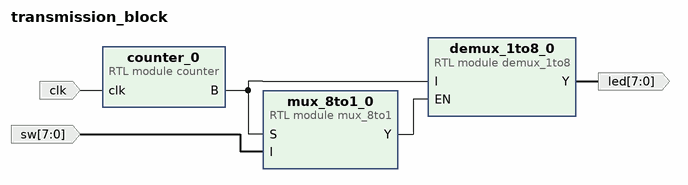
[diagram p0: block diagram of the top level]
# Vivado block design transmission_block, xc7z007sclg400-2, Vivado 2025.1
create_bd_design transmission_block

create_bd_port -dir I -from 7 -to 0 sw
create_bd_port -dir O -from 7 -to 0 led
create_bd_port -dir I -type clk clk

create_bd_cell -type module -reference counter counter_0
create_bd_cell -type module -reference mux_8to1 mux_8to1_0
create_bd_cell -type module -reference demux_1to8 demux_1to8_0

# ---- connections ----

connect_bd_net -net I_0_1 [get_bd_ports sw] [get_bd_pins mux_8to1_0/I]
connect_bd_net -net clk_0_1 [get_bd_ports clk] [get_bd_pins counter_0/clk]
connect_bd_net [get_bd_pins counter_0/B] [get_bd_pins demux_1to8_0/I] [get_bd_pins mux_8to1_0/S]
connect_bd_net [get_bd_pins demux_1to8_0/Y] [get_bd_ports led]
connect_bd_net [get_bd_pins mux_8to1_0/Y] [get_bd_pins demux_1to8_0/EN]

validate_bd_design
save_bd_design
